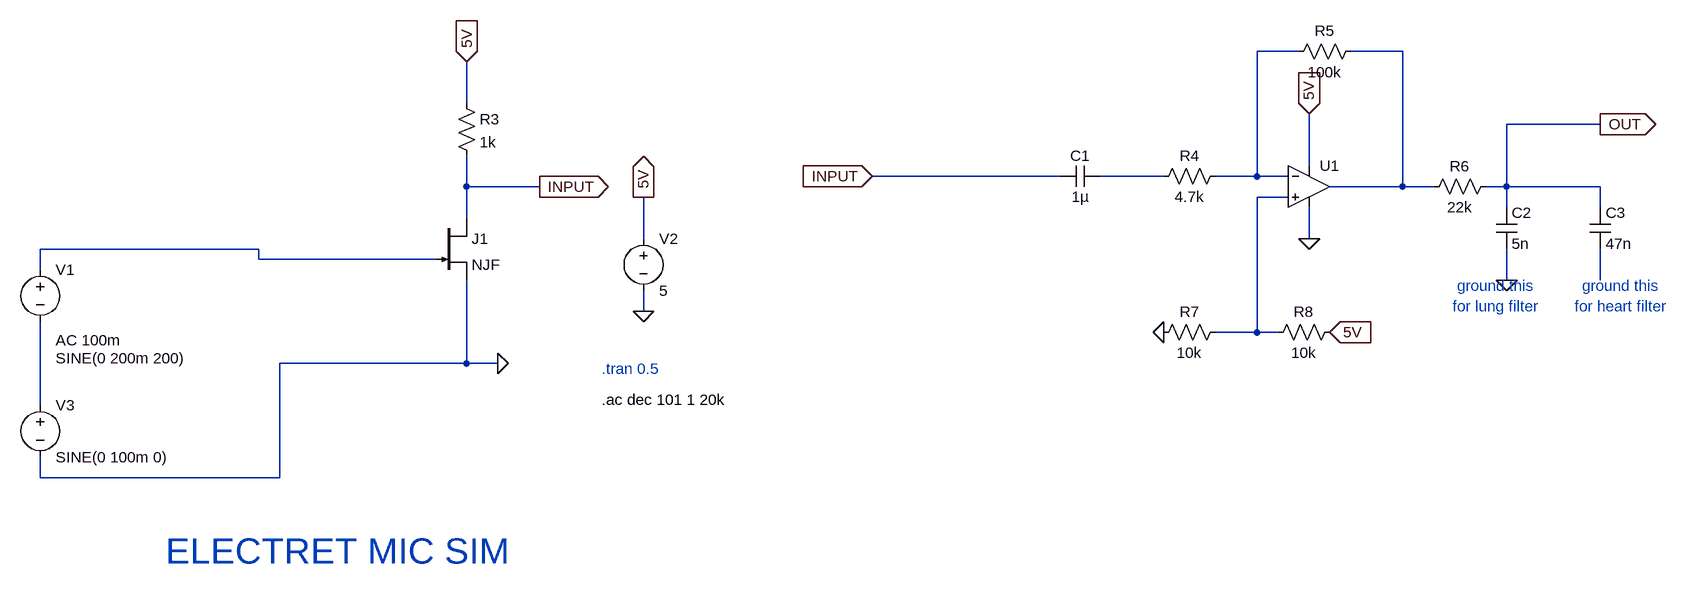
[diagram p0: schematic full.asc]
full.asc, the LTspice schematic file:
Version 4
SHEET 1 3072 2204
WIRE 656 528 592 528
WIRE 816 528 736 528
WIRE -624 608 -624 544
WIRE 1120 640 976 640
WIRE 672 704 672 624
WIRE 288 720 0 720
WIRE 448 720 352 720
WIRE 592 720 592 528
WIRE 592 720 528 720
WIRE 640 720 592 720
WIRE -624 736 -624 688
WIRE -512 736 -624 736
WIRE 816 736 816 528
WIRE 816 736 704 736
WIRE 864 736 816 736
WIRE 976 736 976 640
WIRE 976 736 944 736
WIRE 1120 736 976 736
WIRE 640 752 592 752
WIRE 976 768 976 736
WIRE 1120 768 1120 736
WIRE -624 784 -624 736
WIRE -352 816 -352 752
WIRE 672 816 672 768
WIRE -944 832 -1280 832
WIRE -944 848 -944 832
WIRE -672 848 -944 848
WIRE -1280 864 -1280 832
WIRE 976 880 976 832
WIRE 1120 880 1120 832
WIRE -352 928 -352 896
WIRE 592 960 592 752
WIRE 592 960 528 960
WIRE 624 960 592 960
WIRE -624 1008 -624 880
WIRE -624 1008 -912 1008
WIRE -576 1008 -624 1008
WIRE -1280 1072 -1280 944
WIRE -1280 1184 -1280 1152
WIRE -912 1184 -912 1008
WIRE -912 1184 -1280 1184
FLAG -576 1008 0
FLAG -512 736 INPUT
IOPIN -512 736 Out
FLAG -352 928 0
FLAG -352 752 5V
IOPIN -352 752 Out
FLAG -624 544 5V
IOPIN -624 544 In
FLAG 0 720 INPUT
IOPIN 0 720 In
FLAG 672 624 5V
IOPIN 672 624 In
FLAG 448 960 0
FLAG 704 960 5V
IOPIN 704 960 In
FLAG 672 816 0
FLAG 1120 640 OUT
IOPIN 1120 640 Out
FLAG 976 880 0
SYMBOL voltage -1280 848 R0
WINDOW 123 24 124 Left 2
WINDOW 39 0 0 Left 0
WINDOW 3 24 152 Left 2
SYMATTR Value2 AC 100m
SYMATTR Value SINE(0 200m 200)
SYMATTR InstName V1
SYMBOL njf -672 784 R0
SYMATTR InstName J1
SYMBOL res -640 592 R0
SYMATTR InstName R3
SYMATTR Value 1k
SYMBOL voltage -352 800 R0
WINDOW 123 0 0 Left 0
WINDOW 39 0 0 Left 0
SYMATTR InstName V2
SYMATTR Value 5
SYMBOL voltage -1280 1056 R0
WINDOW 123 0 0 Left 0
WINDOW 39 0 0 Left 0
SYMATTR InstName V3
SYMATTR Value SINE(0 100m 0)
SYMBOL res 544 704 R90
WINDOW 0 0 56 VBottom 2
WINDOW 3 32 56 VTop 2
SYMATTR InstName R4
SYMATTR Value 4.7k
SYMBOL cap 352 704 R90
WINDOW 0 0 32 VBottom 2
WINDOW 3 32 32 VTop 2
SYMATTR InstName C1
SYMATTR Value 1µ
SYMBOL OpAmps\\UniversalOpAmp 672 736 R0
SYMATTR InstName U1
SYMBOL res 752 512 R90
WINDOW 0 0 56 VBottom 2
WINDOW 3 32 56 VTop 2
SYMATTR InstName R5
SYMATTR Value 100k
SYMBOL res 960 720 R90
WINDOW 0 0 56 VBottom 2
WINDOW 3 32 56 VTop 2
SYMATTR InstName R6
SYMATTR Value 22k
SYMBOL cap 960 768 R0
SYMATTR InstName C2
SYMATTR Value 5n
SYMBOL res 544 944 R90
WINDOW 0 0 56 VBottom 2
WINDOW 3 32 56 VTop 2
SYMATTR InstName R7
SYMATTR Value 10k
SYMBOL res 720 944 R90
WINDOW 0 0 56 VBottom 2
WINDOW 3 32 56 VTop 2
SYMATTR InstName R8
SYMATTR Value 10k
SYMBOL cap 1104 768 R0
SYMATTR InstName C3
SYMATTR Value 47n
TEXT -416 1016 Left 2 ;.tran 0.5
TEXT -824 1296 Center 5 ;ELECTRET MIC SIM
TEXT -416 1064 Left 2 !.ac dec 101 1 20k
TEXT 960 904 Center 2 ;ground this\nfor lung filter
TEXT 1152 904 Center 2 ;ground this\nfor heart filter

The netlist it stands for:
* full.asc
V1 N005 N007 SINE(0 200m 200) AC 100m
J1 INPUT N005 0 NJF
R3 5V INPUT 1k
V2 5V 0 5
V3 N007 0 SINE(0 100m 0)
R4 N001 N003 4.7k
C1 N003 INPUT 1µ
XU1 N004 N001 5V 0 N002 level1 Avol=1Meg GBW=10Meg Vos=0 En=0 Enk=0 In=0 Ink=0 Rin=500Meg  ; pins In+ In- V+ V- OUT
R5 N002 N001 100k
R6 OUT N002 22k
C2 OUT 0 5n
R7 N004 0 10k
R8 5V N004 10k
C3 OUT N006 47n
.model NJF NJF
.model PJF PJF
.lib standard.jft
* .tran 0.5
* ELECTRET MIC SIM
.ac dec 101 1 20k
* ground this
* for lung filter
* ground this
* for heart filter
.lib UniversalOpAmp1.lib
.backanno
.end